# Altium schematic sheet ZYNQ_PL_Bank_13.SchDoc
size A4; DocumentNumber: 4; SheetNumber: 4; SheetTotal: 47
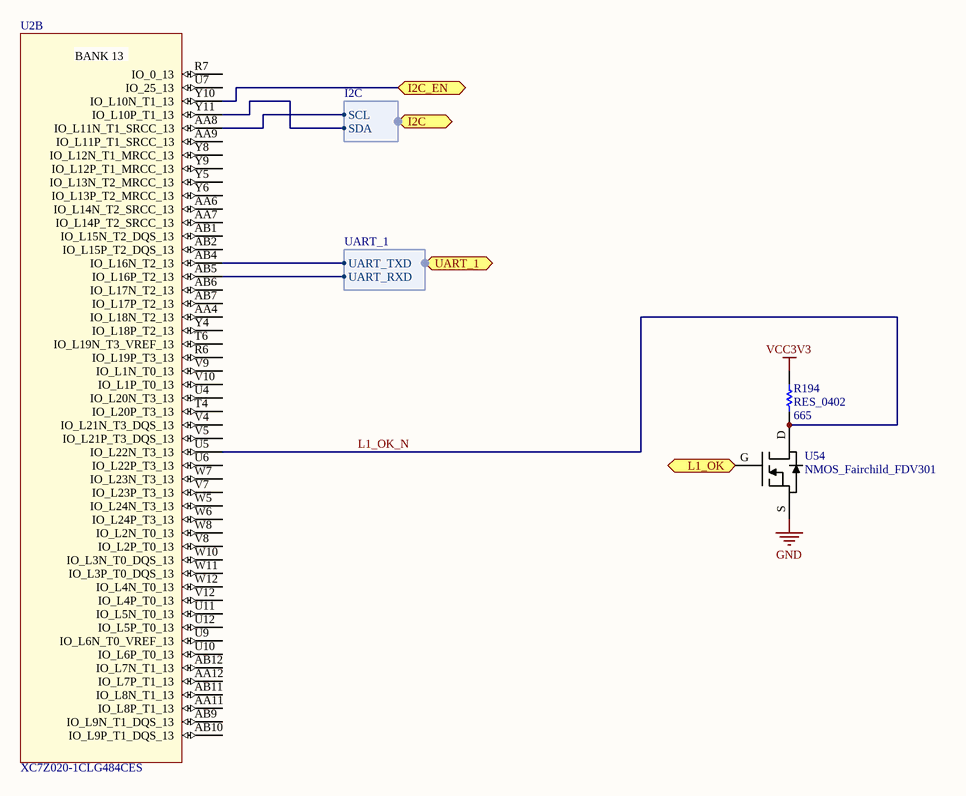
[diagram p0: ZYNQ_PL_Bank_13.SchDoc]

## Parts
R194  RES_0402  value 665  [RESC0402(1005)_N]
U2  XC7Z020-1CLG484CES  [ZYNQ_xc7z020clg484pkg_BGA-484]  (part B of 10)
U54  NMOS_Fairchild_FDV301  [NMOS_Fairchild_FDV301_SOT23-3]

## Ports
I2C (harness I2C), I2C_EN, L1_OK, UART_1 (harness UART_1)

## Harnesses
UART_1: UART_TXD, UART_RXD
I2C: SCL, SDA

## Nets
GND: U54.S
VCC3V3: R194.2
I2C_EN: U2.Y10(IO_L10N_T1_13) ; port I2C_EN
L1_OK: U54.G ; port L1_OK
L1_OK_N: R194.1 U2.U5(IO_L22N_T3_13) U54.D
NetU2_AA8: U2.AA8(IO_L11N_T1_SRCC_13) ; port I2C.SCL
NetU2_AB4: U2.AB4(IO_L16N_T2_13) ; port UART_1.UART_TXD
NetU2_AB5: U2.AB5(IO_L16P_T2_13) ; port UART_1.UART_RXD
NetU2_Y11: U2.Y11(IO_L10P_T1_13) ; port I2C.SDA

Not connected (* = marked no-connect by the designer): U2 AA4(IO_L18N_T2_13) AA6(IO_L14N_T2_SRCC_13) AA7(IO_L14P_T2_SRCC_13) AA9(IO_L11P_T1_SRCC_13) AA11(IO_L8P_T1_13) AA12(IO_L7P_T1_13) AB1(IO_L15N_T2_DQS_13) AB2(IO_L15P_T2_DQS_13) AB6(IO_L17N_T2_13) AB7(IO_L17P_T2_13) AB9(IO_L9N_T1_DQS_13) AB10(IO_L9P_T1_DQS_13) AB11(IO_L8N_T1_13) AB12(IO_L7N_T1_13) R6(IO_L19P_T3_13) R7(IO_0_13) T4(IO_L20P_T3_13) T6(IO_L19N_T3_VREF_13) U4(IO_L20N_T3_13) U6(IO_L22P_T3_13) U7(IO_25_13) U9(IO_L6N_T0_VREF_13) U10(IO_L6P_T0_13) U11(IO_L5N_T0_13) U12(IO_L5P_T0_13) V4(IO_L21N_T3_DQS_13) V5(IO_L21P_T3_DQS_13) V7(IO_L23P_T3_13) V8(IO_L2P_T0_13) V9(IO_L1N_T0_13) V10(IO_L1P_T0_13) V12(IO_L4P_T0_13) W5(IO_L24N_T3_13) W6(IO_L24P_T3_13) W7(IO_L23N_T3_13) W8(IO_L2N_T0_13) W10(IO_L3N_T0_DQS_13) W11(IO_L3P_T0_DQS_13) W12(IO_L4N_T0_13) Y4(IO_L18P_T2_13) Y5(IO_L13N_T2_MRCC_13) Y6(IO_L13P_T2_MRCC_13) Y8(IO_L12N_T1_MRCC_13) Y9(IO_L12P_T1_MRCC_13)

## Notes on the sheet
- (in symbol XC7Z020-1CLG484CES, part B) BANK 13

## Library data of the parts
R194 = ERJ-2RKF6650X: RES 665 OHM 1/10W 1% 0402 SMD; Manufacturer: Panasonic Electronic Components; Tolerance: *; Part Number: ERJ-2RKF6650X; Footprint Ref: RESC0402(1005)_N; Library Ref: RES_0402
U2 = XC7Z020-1CLG484CES: XC7Z020-1CLG484CES, Zynq-7000 All Programmable SoC; Manufacturer: Xilinx; Part Number: XC7Z020-1CLG484CES
U54 = FDV301N: MOSFET N-CH 25V 220MA SOT-23; Manufacturer: Fairchild Semiconductor; Part Number: FDV301N; Footprint Ref: NMOS_Fairchild_FDV301_SOT23-3; Library Ref: NMOS_Fairchild_FDV301